# EasyEDA schematic D4_2020-10-05_17-04-56.json
TITLE: SmartWatch D2; REV: 1.0; Date: 2017-10-20; Sheet: 1/1; Drawn By: Jake Drew
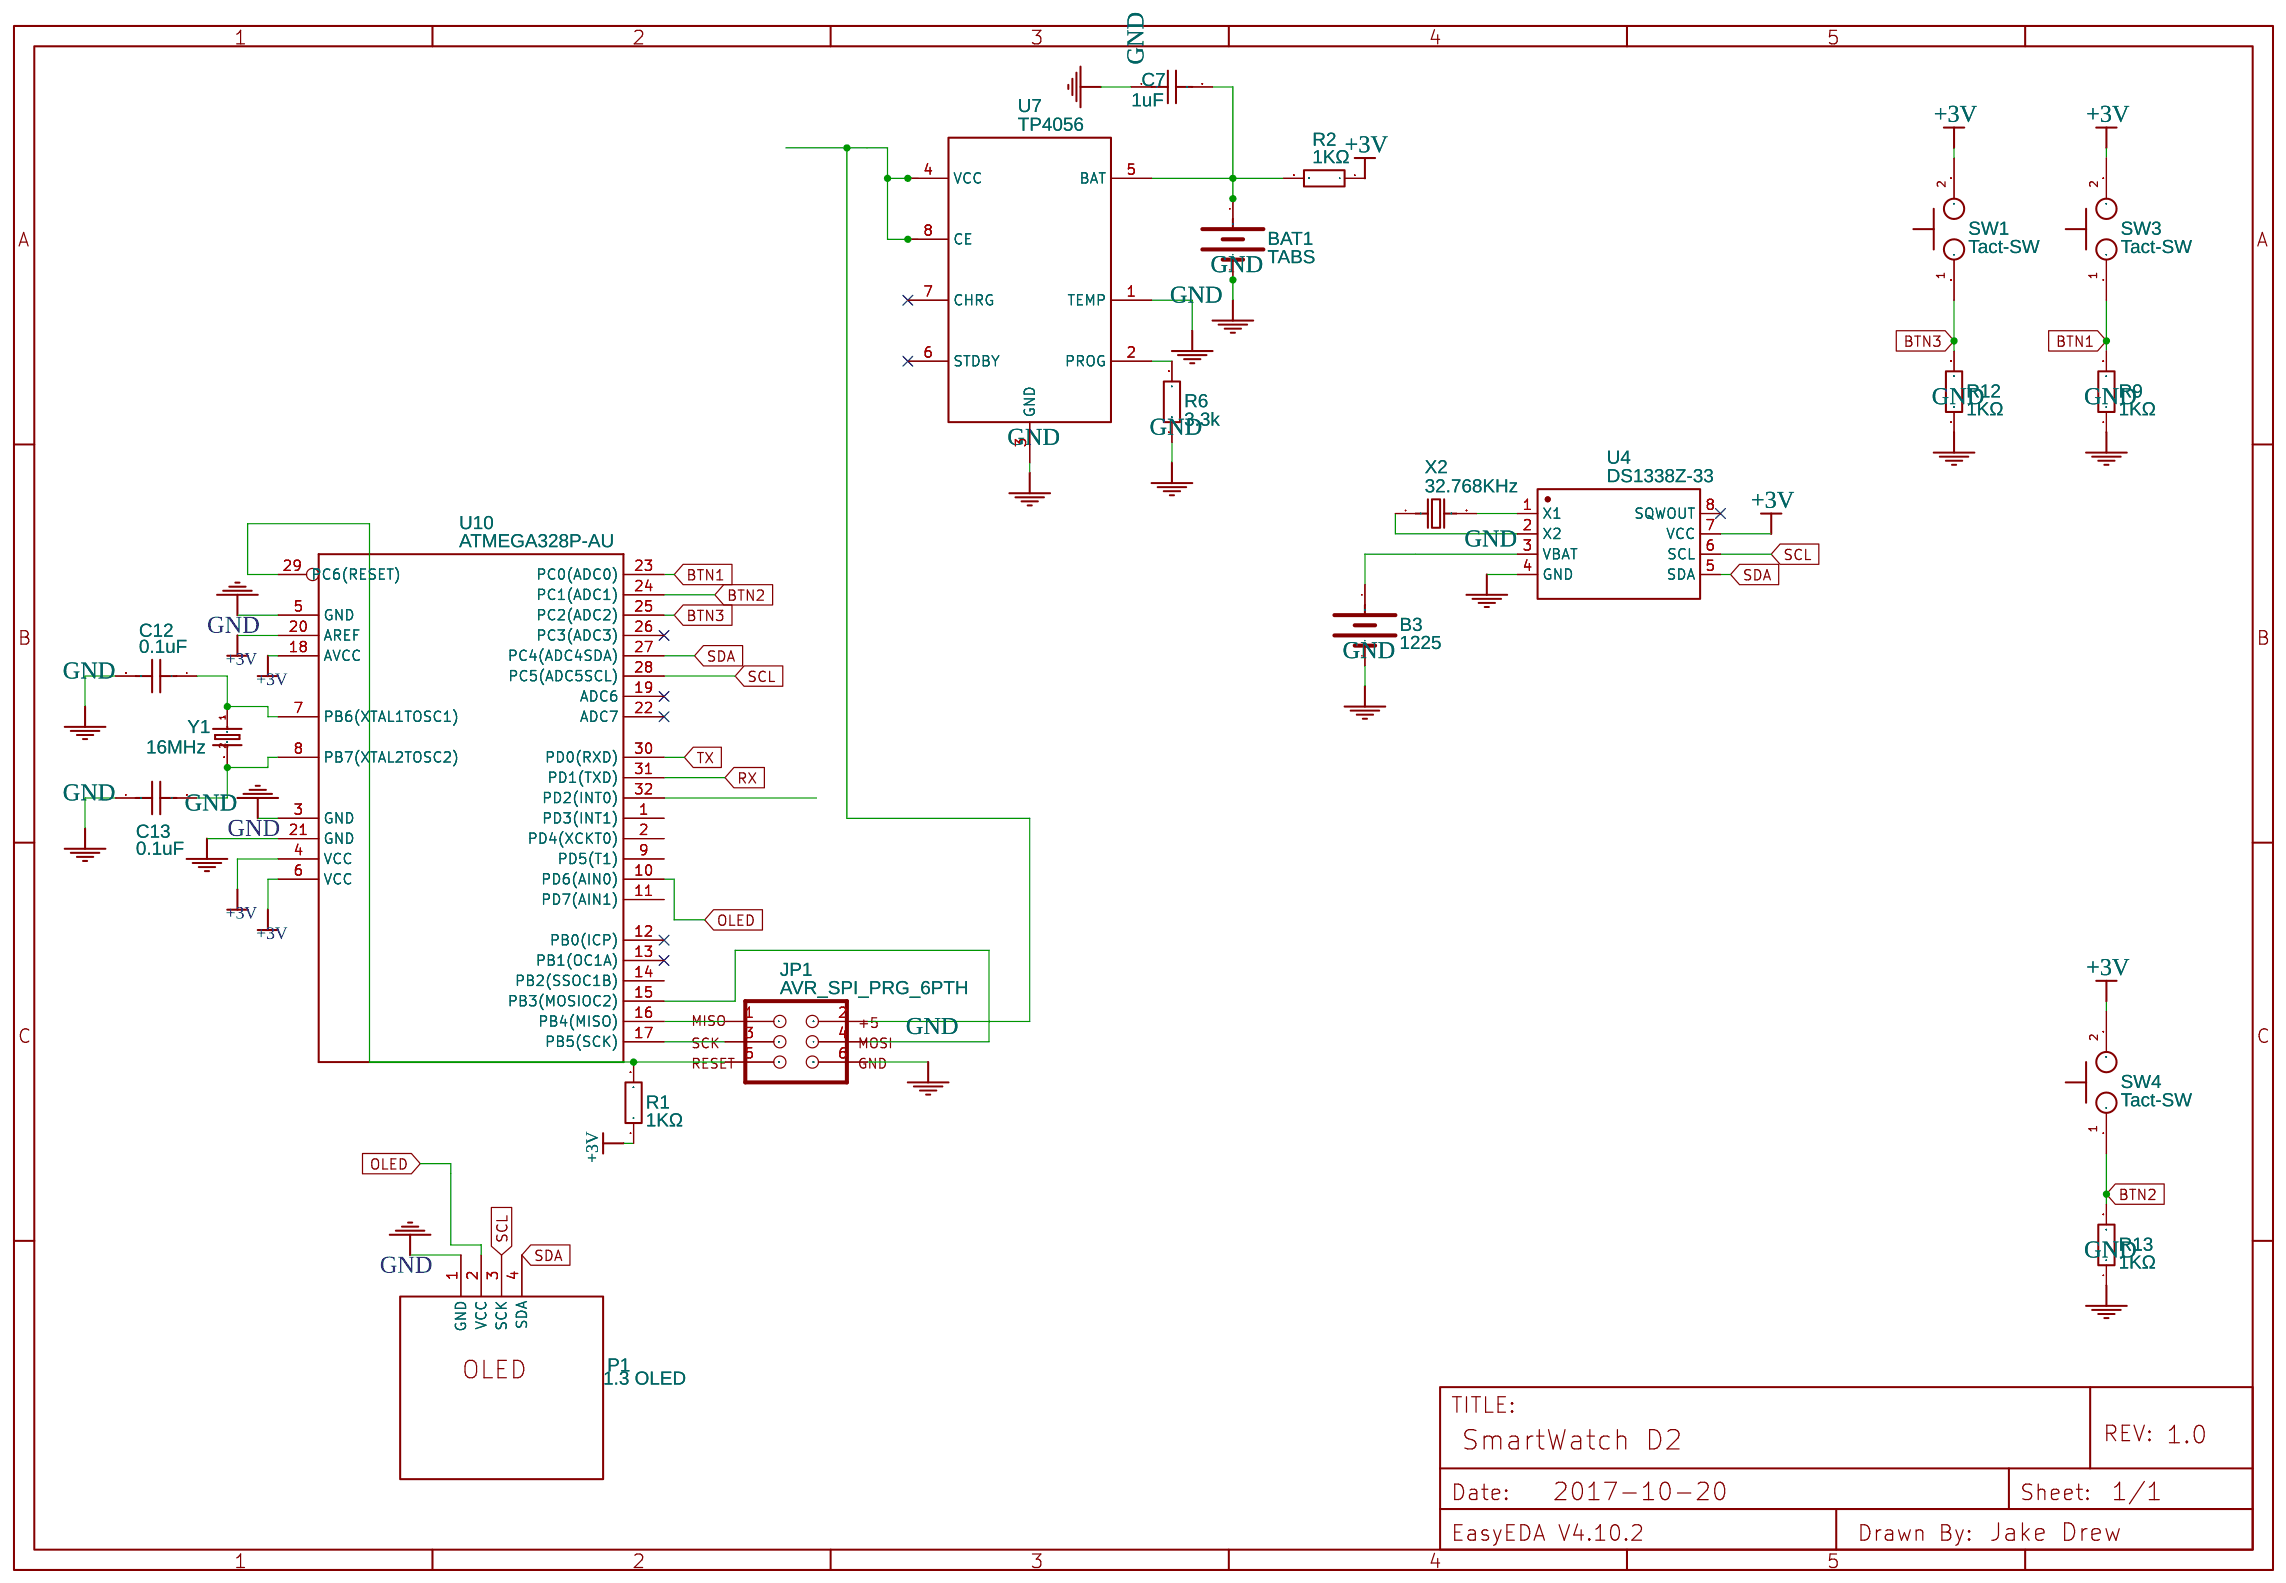
[diagram p0: schematic sheet]

## Parts
B3  1225  [LIPO-110-TABS]
BAT1  TABS  [LIPO-110-TABS]
C7  1uF  [0805]
C12  0.1uF  [0805]
C13  0.1uF  [0805]
JP1  AVR_SPI_PRG_6PTH  [2X3]
P1  1.3 OLED  [OLED 1.3 IIC/I2C]
R1  1KΩ  [1206]
R2  1KΩ  [1206]
R6  3.3k  [1210]
R9  1KΩ  [1206]
R12  1KΩ  [1206]
R13  1KΩ  [1206]
SW1  Tact-SW  [TL3330AF260QG_3D]
SW3  Tact-SW  [TL3330AF260QG_3D]
SW4  Tact-SW  [TL3330AF260QG_3D]
U4  DS1338Z-33  [SOP-8_150MIL]
U7  TP4056  [SOP-8_EP_150MIL]
U10  ATMEGA328P-AU  [TQFP32-0.8-7X7MM]
X2  32.768KHz  [3*8]
Y1  16MHz  [X2-SMD-5.0X3.2X1.3MM]

## Library data of the parts
B3 BAT1 = -: Battery Holders; catid: 20; Contributor: SparkFun; Manufacturer Part: ?
C7 C12 C13 = -: Voltage: 25V; Tolerance: ±10%; Supplier: LCSC; Manufacturer: FH(风华); Manufacturer Part: 0805B105K250NT; Supplier Part: C89190
JP1 = -: AVR ISP 6 Pin; catid: 20; Contributor: SparkFun; Manufacturer Part: ?
P1 = -: catid: 20; sourceId: 1T5FDZYC8; Supplier: Aliexpress; Manufacturer Part: ?
R1 R2 R9 R12 R13 = -: Power: 1/4W; Tolerance: ±1%; Supplier: LCSC; Manufacturer: UniOhm; Manufacturer Part: 1206W4F1001T5E; LCSC Assembly: Yes; Supplier Part: C4410
R6 = -: Power: 1/3W; Tolerance: ±1%; Supplier: LCSC; Manufacturer: UniOhm; Manufacturer Part: 1210W3F680KT5E; Supplier Part: C38887
SW1 SW3 SW4 = -: Manufacturer Part: TL3330AF260QG; link: https://www.semikart.com/product/TL3330AF260QG/168338; Contributor: ChethuGowda; Supplier: Mouser
U4 = -: Supplier: LCSC; Manufacturer: MAXIM; Supplier Part: C49105
U7 = -: Contributor: Guest; Supplier: LCSC; Manufacturer: TOPPOWER; LCSC Assembly: Yes; Supplier Part: C16581
U10 = -: IC MCU 8Bit 32KB ISP flash 20MHz  1.8v-5.5v; catid: 20
X2 = -: Supplier: LCSC; Manufacturer: KDS; Manufacturer Part: DT-38 32.768KHz; Supplier Part: C93228
Y1 = -: SMD 16MHz-8pF-20ppm-40R; catid: 20; Manufacturer Part: X053201602002

## Nets
+3V: R1.1 R2.1 SW1.2 SW3.2 SW4.2 U4.7(VCC) U10.4(VCC) U10.6(VCC) U10.18(AVCC) U10.20(AREF)
GND: B3.- BAT1.- C7.1 C12.2 C13.1 JP1.6 P1.1(GND) R6.1 R9.1 R12.1 R13.1 U4.4(GND) U7.1(TEMP) U7.3(GND) U10.3(GND) U10.5(GND) U10.21(GND)
BTN1: R9.2 SW3.1 U10.23(PC0(ADC0))
BTN2: R13.2 SW4.1 U10.24(PC1(ADC1))
BTN3: R12.2 SW1.1 U10.25(PC2(ADC2))
OLED: P1.2(VCC) U10.10(PD6(AIN0))
RX: U10.31(PD1(TXD))
SCL: P1.3(SCK) U4.6(SCL) U10.28(PC5(ADC5SCL))
SDA: P1.4(SDA) U4.5(SDA) U10.27(PC4(ADC4SDA))
TX: U10.30(PD0(RXD))
Net-(B3-+): B3.+ U4.3(VBAT)
Net-(BAT1-+): BAT1.+ C7.2 R2.2 U7.5(BAT)
Net-(C12-1): C12.1 U10.7(PB6(XTAL1TOSC1)) Y1.1
Net-(C13-2): C13.2 U10.8(PB7(XTAL2TOSC2)) Y1.2
Net-(JP1-1): JP1.1 U10.16(PB4(MISO))
Net-(JP1-2): JP1.2 U7.4(VCC) U7.8(CE)
Net-(JP1-3): JP1.3 U10.17(PB5(SCK))
Net-(JP1-4): JP1.4 U10.15(PB3(MOSIOC2))
Net-(JP1-5): JP1.5 R1.2 U10.29(PC6(RESET))
Net-(R6-2): R6.2 U7.2(PROG)
Net-(U4-1): U4.1(X1) X2.2
Net-(U4-2): U4.2(X2) X2.1

Not connected (* = marked no-connect by the designer): U4 8(SQWOUT)*; U7 6(STDBY)* 7(CHRG)*; U10 1(PD3(INT1)) 2(PD4(XCKT0)) 9(PD5(T1)) 11(PD7(AIN1)) 12(PB0(ICP))* 13(PB1(OC1A))* 14(PB2(SSOC1B)) 19(ADC6)* 22(ADC7)* 26(PC3(ADC3))* 32(PD2(INT0))
